# Altium project Modulo_Wifi_Pedidos_Domicilo.PrjPcb
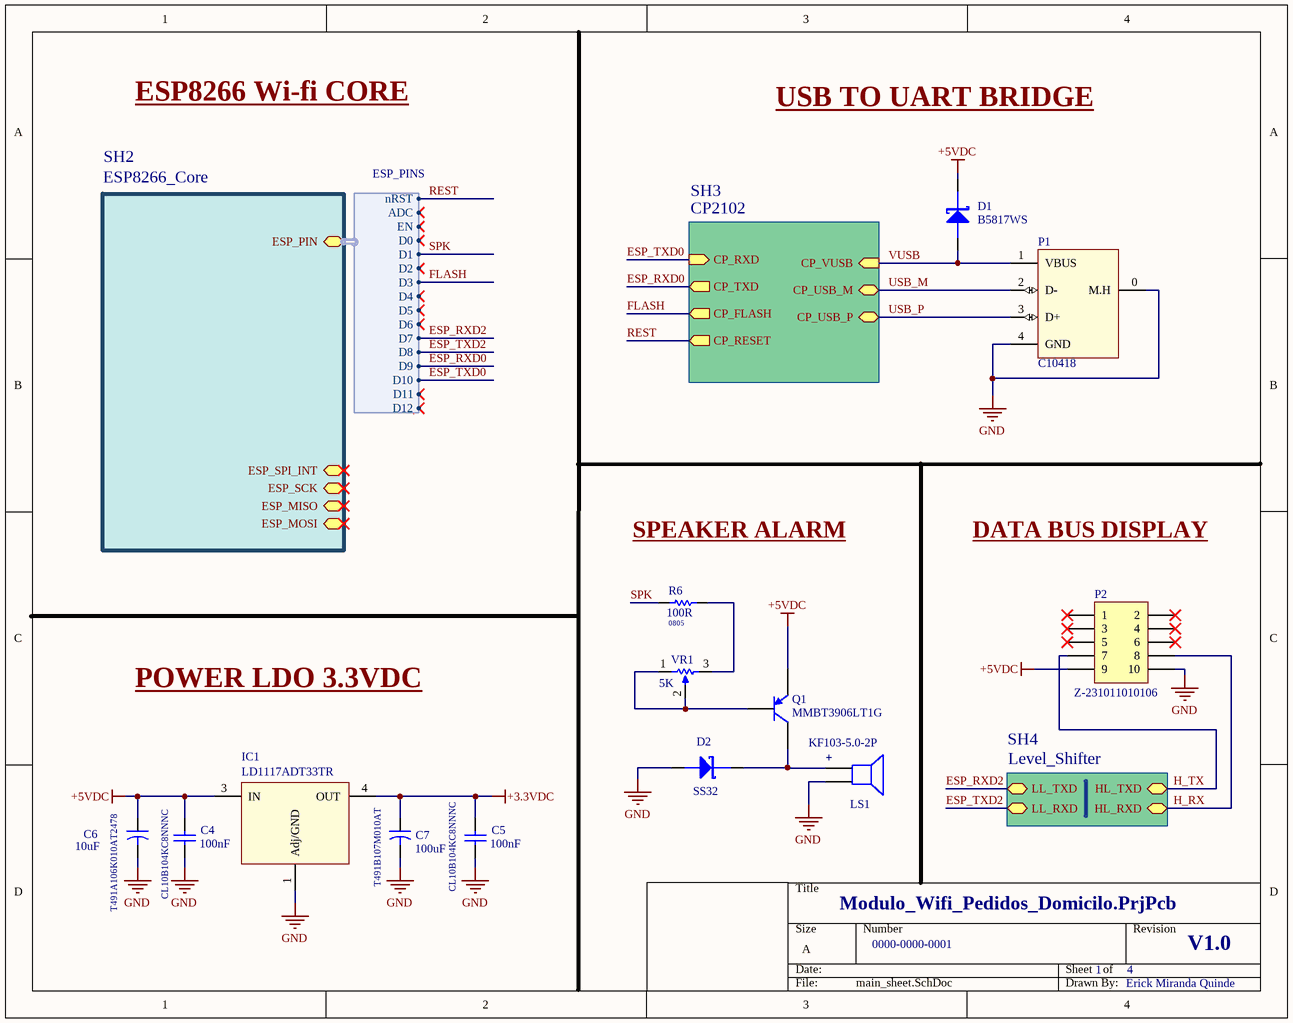
[diagram p0: main_sheet.SchDoc]
5 sheets, 47 parts. Net scope: hierarchical (ports join the sheet entries above them; power ports are global).
Board files: BOARD.PcbDoc, Edge_Board.PcbDoc
Sheets:
  main_sheet.SchDoc
    SH3 = CP2102.SchDoc
  ESP32_Core.SchDoc
  PAM8403.SchDoc
  LD1117.SchDoc

## Sheet main_sheet.SchDoc
size A; Author: Erick Miranda Quinde; DrawnBy: Erick Miranda Quinde; Engineer: Erick Miranda Quinde; DocumentNumber: 0000-0000-0001; Revision: V1.0; SheetNumber: 1; SheetTotal: 4

### Parts
(Parts that share a designator on the sheet are numbered #1, #2 ... from top to bottom, then left to right.)
C4  CL10B104KC8NNNC  value 100nF  [C0603C104K5RACTU]
C5#1  CL10B104KC8NNNC  value 100nF  [C0603C104K5RACTU]
C6#1  T491A106K010AT2478  value 10uF  [3216 Case-A]
C7#1  T491B107M010AT  value 100uF  [TAJB107M006RNJ]
D1  B5817WS  [Diode S4]
D2  SS32  [DO-214AC)]
IC1  LD1117ADT33TR  [TO252]
LS1#1  KF103-5.0-2P  [VERDE 2pin]
P1  C10418  [USB_MICRO_B_AT]
P2  Z-231011010106  [IDC5X2]
Q1  MMBT3906LT1G  [SOT-23-TT3_N]
R6#1  value 100R  Package: 0805  [RES-0805]  (hidden comment: TC0525D1000T5E)
VR1  value 5K  [POT LIN VR1]  (hidden comment: 3362P-1-502LF)

### Sub-sheets
SH2 = ESP8266_Core (file not in this document): ESP_PIN (harness ESP_PINS), ESP_SCK, ESP_MISO, ESP_MOSI, ESP_SPI_INT
SH3 = CP2102: CP_USB_M (bidir), CP_USB_P (bidir), CP_VUSB (in), CP_RXD (in), CP_TXD (out), CP_FLASH (out), CP_RESET (out)
SH4 = Level_Shifter (file not in this document): HL_TXD, HL_RXD, LL_TXD, LL_RXD

### Harnesses
ESP_PINS: D12, D11, D10, D9, D3, D8, D7, D6, D5, D4, D2, D1, D0, EN, ADC, nRST

### Nets
+3.3VDC: C5#1.2 C7#1.1 IC1.4(OUT)
+5VDC: C4.2 C6#1.1 D1.1(K) IC1.3(IN) P2.9 Q1.2(E)
GND: C4.1 C5#1.1 C6#1.2 C7#1.2 D2.2(A) IC1.1(Adj/GND) LS1#1.2 P1.0(M.H) P1.4(GND) P2.10
ESP_RXD0: sheet SH3/CP_TXD, sheet SH2/ESP_PIN.D9
ESP_RXD2: sheet SH4/LL_TXD, sheet SH2/ESP_PIN.D7
ESP_TXD0: sheet SH3/CP_RXD, sheet SH2/ESP_PIN.D10
ESP_TXD2: sheet SH4/LL_RXD, sheet SH2/ESP_PIN.D8
FLASH: sheet SH3/CP_FLASH, sheet SH2/ESP_PIN.D3
H_RX: P2.8 ; sheet SH4/HL_RXD
H_TX: P2.7 ; sheet SH4/HL_TXD
REST: sheet SH3/CP_RESET, sheet SH2/ESP_PIN.nRST  [project net nRST]
SPK: R6#1.1 ; sheet SH2/ESP_PIN.D1
USB_M: P1.2(D-) ; sheet SH3/CP_USB_M
USB_P: P1.3(D+) ; sheet SH3/CP_USB_P
VUSB: D1.2(A) P1.1(VBUS) ; sheet SH3/CP_VUSB
NetD2_1: D2.1(K) LS1#1.1 Q1.3(C)
NetQ1_1: Q1.1(B) VR1.1 VR1.2
NetR6#1_2: R6#1.2 VR1.3

Not connected (* = marked no-connect by the designer): P2 1* 2* 3* 4* 5* 6*

### Notes on the sheet
- ESP8266 Wi-fi CORE
- USB TO UART BRIDGE
- SPEAKER ALARM
- DATA BUS DISPLAY
- POWER LDO 3.3VDC
- (near LS1#1) +

### Library data of the parts
C4 C5#1 = Cap 100nF (0603): PART_NUM: CL10B104KC8NNNC; Price: $0.02; Link Store: https://lcsc.com/product-detail/Multilayer-Ceramic-Capacitors-MLCC-SMD-SMT_SAMSUNG_CL10B104KC8NNNC_100nF-104-10-100V_C15725.html; LCSC Part: C15725
C6#1 = T491A106M006AT: CAP TANT 10UF 6.3V 20% 1206; Price: $0.11; Link Store: https://lcsc.com/product-detail/Tantalum-Capacitors_KEMET_T491A106K010AT_10uF-106-10-10V_C110052.html; LCSC Part: C110052
C7#1 = Cap 10uF (C3216): Capacitor; Price: $0.29; Link Store: https://lcsc.com/product-detail/Tantalum-Capacitors_KEMET-T491B107M010AT_C90975.html; LCSC Part: C90975
D1 = 1N5817: Price: $0.0211; Link Store: https://lcsc.com/product-detail/Schottky-Barrier-Diodes-SBD_Shikues-B5817WS_C122854.html; LCSC Part: C122854
D2 = CD214A-B340LF: DIODE SCHOTTKY 40V 3A SMA; Price: $0.03; Link Store: https://lcsc.com/product-detail/Schottky-Barrier-Diodes-SBD_MDD-Microdiode-Electronics-SS32_C34897.html; LCSC Part: C34897
IC1 = LM1117DT: 800mA Low-Dropout Linear Regulator; Manufacturer: National Semiconductor; Datasheet: http://www.national.com/ds/LM/LM1117.pdf; Price: $0.96; Link Store: https://lcsc.com/product-detail/Low-Dropout-Regulators-LDO_STMicroelectronics-LD1117ADT33TR_C157401.html; LCSC Part: C157401
LS1#1 = Speaker: Published: 24-Mar-1999; LatestRevisionDate: 17-Jul-2002; LatestRevisionNote: Re-released for DXP Platform.; PackageReference: PIN2; Publisher: Altium Limited; Price: $0.12; Link Store: https://lcsc.com/product-detail/New-Quadratic-Unclassified-Data_Cixi-Kefa-Elec-KF103-5-0-2P_C475088.html; LCSC Part: C475088
P1 = USB Mini: USB Micro; Price: $0.06; Link Store: https://lcsc.com/product-detail/USB-Connectors_Jing-Extension-of-the-Electronic-Co-Jing-Extension-of-the-Electronic-Co-MICRO-USB-5S-B-Type-horns-High-temperature_C10418.html; LCSC Part: C10418
P2 = IDC  5X2: Header, 5-Pin, Dual row; LatestRevisionDate: 17-Jul-2002; LatestRevisionNote: Re-released for DXP Platform.; Publisher: Altium Limited; Price: $0.16; Link Store: https://lcsc.com/product-detail/IDC-Connectors_nextron-Nextronics-Engineering-Z-231011010106_C221045.html; LCSC Part: C221045
Q1 = 2N3906: Manufacturer: Micro Commercial Co; Manufacturer Part Number: 2N3906-AP; Transistor Type: PNP; Current - Collector (Ic) (Max): 200mA; Voltage - Collector Emitter Breakdown (Max): 40V; Vce Saturation (Max) @ Ib, Ic: 400mV @ 5mA, 50mA; DC Current Gain (hFE) (Min) @ Ic, Vce: 100 @ 10mA, 1V; Power - Max: 600mW; Frequency - Transition: 250MHz; Supplier 1: Digi-Key; RoHS: RoHS Compliant; Category: Discrete Semiconductor Products; Stock 1: 54000; Pricing 1: 2000=0.0306, 6000=0.0276, 10000=0.024, 50000=0.0192, 100000=0.018, 200000=0.01596 (USD); Packaging: Tape & Box (TB); Current - Collector Cutoff (Max): -; Mounting Type: Through Hole; Package / Case: TO-226-3, TO-92-3 (TO-226AA) Formed Leads; Supplier Device Package: TO-92; ComponentLink1URL: http://www.mccsemi.com/up_pdf/2N3906(TO-92).pdf; ComponentLink1Description: http://www.mccsemi.com/up_pdf/2N3906(TO-92).pdf; Supplier Part Number 1: 2N3906-APTB-ND; Price: $0.0072; Link Store: https://lcsc.com/product-detail/Transistors-NPN-PNP_ON-Semiconductor-MMBT3906LT1G_C53444.html; LCSC Part: C53444
R6#1 = Resistor: Published: 8-Jun-2000; LatestRevisionDate: 17-Jul-2002; LatestRevisionNote: Re-released for DXP Platform.; PackageReference: AXIAL-0.3; Publisher: Altium Limited; PackageDescription: Axial Device, Thru-Hole; 2 Leads; 0.3 in Pin Spacing; Price: $0.024; Link Store: https://lcsc.com/product-detail/High-Precision-Low-TCR-SMD-Resistors_UNI-ROYAL-Uniroyal-Elec-TC0525D1000T5E_C44786.html; LCSC Part: C44786
VR1 = Trimmer Cermet 104: Price: $0.22; PARTNUM: 3362P-1-502LF; Link Store: https://lcsc.com/product-detail/Precision-Potentiometer_BOURNS_3362P-1-502LF_5KR_C81260.html; LCSC Part: C81260

## Sheet CP2102.SchDoc
size A; Author: Erick Miranda Quinde; DrawnBy: Erick Miranda Quinde; DocumentNumber: 0000-0000-0003; Revision: V1.0; SheetNumber: 3; SheetTotal: 4
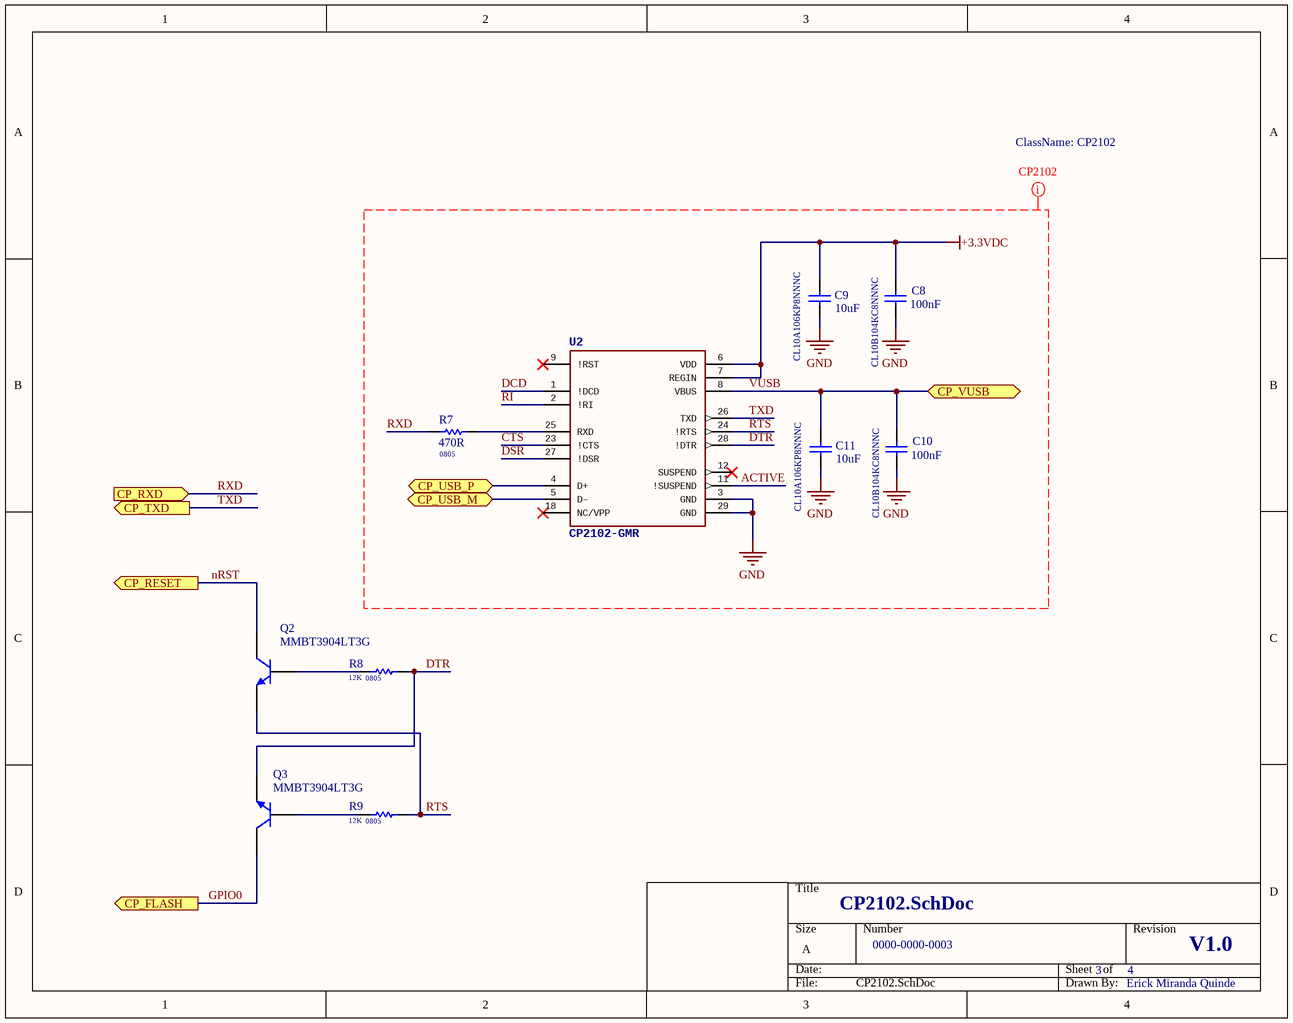
[diagram p1: CP2102.SchDoc]

### Parts
(Parts that share a designator on the sheet are numbered #1, #2 ... from top to bottom, then left to right.)
C8#1  CL10B104KC8NNNC  value 100nF  [C0603C104K5RACTU]
C9#1  CL10A106KP8NNNC  value 10uF  [C0603C104K5RACTU]
C10#1  CL10B104KC8NNNC  value 100nF  [C0603C104K5RACTU]
C11#1  CL10A106KP8NNNC  value 10uF  [C0603C104K5RACTU]
Q2  MMBT3904LT3G  [SOT-23-TT3_N]
Q3  MMBT3904LT3G  [SOT-23-TT3_N]
R7#1  value 470R  Package: 0805  [RES-0805]  (hidden comment: 0805W8F4700T5E)
R8#1  value 12K  Package: 0805  [RES-0805]  (hidden comment: 0805W8F1202T5E)
R9#1  value 12K  Package: 0805  [RES-0805]  (hidden comment: 0805W8F1202T5E)
U2#1  CP2102-GMR  [QFN50P500X500X100-29N]

### Ports
CP_FLASH (out), CP_RESET (out), CP_RXD (in), CP_TXD (out), CP_USB_M (bidir), CP_USB_P (bidir), CP_VUSB

### Nets
+3.3VDC: C8#1.2 C9#1.2 U2#1.6(VDD) U2#1.7(REGIN)
GND: C8#1.1 C9#1.1 C10#1.1 C11#1.1 U2#1.3(GND) U2#1.29(GND)
ACTIVE: U2#1.11(!SUSPEND)
CTS: U2#1.23(!CTS)
DCD: U2#1.1(!DCD)
DSR: U2#1.27(!DSR)
DTR: Q3.2(E) R8#1.2 U2#1.28(!DTR)
GPIO0: Q3.3(C) ; port CP_FLASH  [project net FLASH]
nRST: Q2.3(C) ; port CP_RESET
RI: U2#1.2(!RI)
RTS: Q2.2(E) R9#1.2 U2#1.24(!RTS)
RXD: R7#1.1 ; port CP_RXD  [project net ESP_TXD0]
TXD: U2#1.26(TXD) ; port CP_TXD  [project net ESP_RXD0]
USB_M: U2#1.5(D–) ; port CP_USB_M
USB_P: U2#1.4(D+) ; port CP_USB_P
VUSB: C10#1.2 C11#1.2 U2#1.8(VBUS) ; port CP_VUSB
NetQ2_1: Q2.1(B) R8#1.1
NetQ3_1: Q3.1(B) R9#1.1
NetR7#1_2: R7#1.2 U2#1.25(RXD)

Not connected (* = marked no-connect by the designer): U2#1 9(!RST)* 12(SUSPEND)* 18(NC/VPP)*

### Layout directives
net class CP2102: +3.3VDC, ACTIVE, CTS, DCD, DSR, DTR, GND, RI, RTS, RXD, TXD, VUSB

### Library data of the parts
C8#1 C9#1 C10#1 C11#1 = Cap 100nF (0603)
  C8#1 C10#1: PART_NUM: CL10B104KC8NNNC; Price: $0.02; Link Store: https://lcsc.com/product-detail/Multilayer-Ceramic-Capacitors-MLCC-SMD-SMT_SAMSUNG_CL10B104KC8NNNC_100nF-104-10-100V_C15725.html; LCSC Part: C15725
  C9#1 C11#1: PART_NUM: CL10A106KP8NNNC; Price: $0.04; Link Store: https://lcsc.com/product-detail/Multilayer-Ceramic-Capacitors-MLCC-SMD-SMT_Samsung-Electro-Mechanics-CL10A106KP8NNNC_C19702.html; LCSC Part: C19702
Q2 Q3 = 2N3904: Price: $0.019; Link Store: https://lcsc.com/product-detail/Transistors-NPN-PNP_ON-Semiconductor-ON-MMBT3904LT3G_C150052.html; LCSC Part: C150052
R7#1 R8#1 R9#1 = Resistor: Published: 8-Jun-2000; LatestRevisionDate: 17-Jul-2002; LatestRevisionNote: Re-released for DXP Platform.; PackageReference: AXIAL-0.3; Publisher: Altium Limited; PackageDescription: Axial Device, Thru-Hole; 2 Leads; 0.3 in Pin Spacing
  R7#1: Price: $0.0025; Link Store: https://lcsc.com/product-detail/Chip-Resistor-Surface-Mount_UNI-ROYAL-Uniroyal-Elec-0805W8F4700T5E_C17710.html; LCSC Part: C17710
  R8#1 R9#1: Price: $0.029; Link Store: https://lcsc.com/product-detail/Chip-Resistor-Surface-Mount_UNI-ROYAL-Uniroyal-Elec-0805W8F1202T5E_C17444.html; LCSC Part: C17444
U2#1 = CP2102-GM: MF: Silicon Labs; Package: VFQFN-28 Vishay Siliconix; Price: $1.6; Availability: Unavailable; MP: CP2102-GMR; Link Store: https://lcsc.com/product-detail/USB-ICs_SILICON-LABS_CP2102-GMR_SILICON-LABS-CP2102-GMR_C6568.html; LCSC Part: C6568

## Sheet ESP32_Core.SchDoc
size A; Author: Erick Miranda Quinde; DrawnBy: Erick Miranda Quinde; DocumentNumber: 0000-0000-0002; Revision: V2.0; SheetNumber: 2; SheetTotal: 5
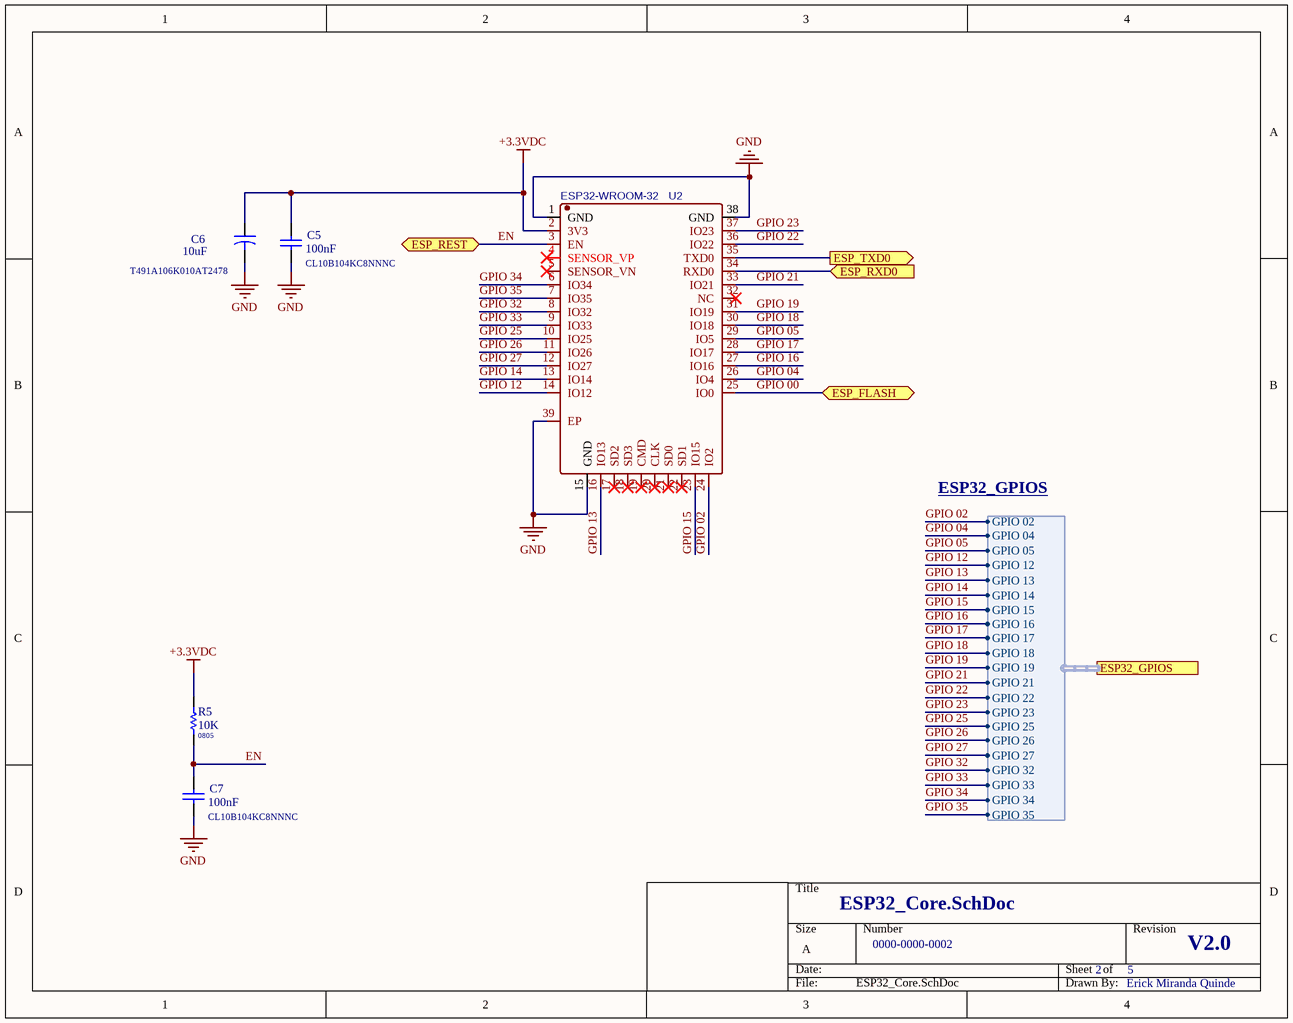
[diagram p2: ESP32_Core.SchDoc]

### Parts
(Parts that share a designator on the sheet are numbered #1, #2 ... from top to bottom, then left to right.)
C5#2  CL10B104KC8NNNC  value 100nF  [C0603C104K5RACTU]
C6#2  T491A106K010AT2478  value 10uF  [3216 Case-A]
C7#2  CL10B104KC8NNNC  value 100nF  [C0603C104K5RACTU]
R5  value 10K  Package: 0805  [RES-0805]  (hidden comment: 0805W8F4700T5E)
U2#2  ESP32-WROOM-32  [ESP-32]

### Ports
ESP32_GPIOS (harness ESP32_GPIOS), ESP_FLASH (bidir), ESP_REST (bidir), ESP_RXD0 (in), ESP_TXD0 (out)

### Harnesses
ESP32_GPIOS: GPIO 02, GPIO 04, GPIO 05, GPIO 12, GPIO 13, GPIO 14, GPIO 15, GPIO 16, GPIO 17, GPIO 18, GPIO 19, GPIO 21, GPIO 22, GPIO 23, GPIO 25, GPIO 26, GPIO 27, GPIO 32, GPIO 33, GPIO 34, GPIO 35

### Nets
+3.3VDC: C5#2.2 C6#2.1 R5.1 U2#2.2(3V3)
GND: C5#2.1 C6#2.2 C7#2.1 U2#2.1(GND) U2#2.15(GND) U2#2.38(GND) U2#2.39(EP)
EN: C7#2.2 R5.2 U2#2.3(EN) ; port ESP_REST
GPIO 00: U2#2.25(IO0) ; port ESP_FLASH
GPIO 02: U2#2.24(IO2) ; port ESP32_GPIOS.GPIO 02
GPIO 04: U2#2.26(IO4) ; port ESP32_GPIOS.GPIO 04
GPIO 05: U2#2.29(IO5) ; port ESP32_GPIOS.GPIO 05
GPIO 12: U2#2.14(IO12) ; port ESP32_GPIOS.GPIO 12
GPIO 13: U2#2.16(IO13) ; port ESP32_GPIOS.GPIO 13
GPIO 14: U2#2.13(IO14) ; port ESP32_GPIOS.GPIO 14
GPIO 15: U2#2.23(IO15) ; port ESP32_GPIOS.GPIO 15
GPIO 16: U2#2.27(IO16) ; port ESP32_GPIOS.GPIO 16
GPIO 17: U2#2.28(IO17) ; port ESP32_GPIOS.GPIO 17
GPIO 18: U2#2.30(IO18) ; port ESP32_GPIOS.GPIO 18
GPIO 19: U2#2.31(IO19) ; port ESP32_GPIOS.GPIO 19
GPIO 21: U2#2.33(IO21) ; port ESP32_GPIOS.GPIO 21
GPIO 22: U2#2.36(IO22) ; port ESP32_GPIOS.GPIO 22
GPIO 23: U2#2.37(IO23) ; port ESP32_GPIOS.GPIO 23
GPIO 25: U2#2.10(IO25) ; port ESP32_GPIOS.GPIO 25
GPIO 26: U2#2.11(IO26) ; port ESP32_GPIOS.GPIO 26
GPIO 27: U2#2.12(IO27) ; port ESP32_GPIOS.GPIO 27
GPIO 32: U2#2.8(IO32) ; port ESP32_GPIOS.GPIO 32
GPIO 33: U2#2.9(IO33) ; port ESP32_GPIOS.GPIO 33
GPIO 34: U2#2.6(IO34) ; port ESP32_GPIOS.GPIO 34
GPIO 35: U2#2.7(IO35) ; port ESP32_GPIOS.GPIO 35
NetU2#2_34: U2#2.34(RXD0) ; port ESP_RXD0
NetU2#2_35: U2#2.35(TXD0) ; port ESP_TXD0

Not connected (* = marked no-connect by the designer): U2#2 4(SENSOR_VP)* 5(SENSOR_VN)* 17(SD2)* 18(SD3)* 19(CMD)* 20(CLK)* 21(SD0)* 22(SD1)* 32(NC)*

### Library data of the parts
C5#2 C7#2 = Cap 100nF (0603): PART_NUM: CL10B104KC8NNNC; Price: $0.02; Link Store: https://lcsc.com/product-detail/Multilayer-Ceramic-Capacitors-MLCC-SMD-SMT_SAMSUNG_CL10B104KC8NNNC_100nF-104-10-100V_C15725.html; LCSC Part: C15725
C6#2 = T491A106M006AT: CAP TANT 10UF 6.3V 20% 1206; Price: $0.11; Link Store: https://lcsc.com/product-detail/Tantalum-Capacitors_KEMET_T491A106K010AT_10uF-106-10-10V_C110052.html; LCSC Part: C110052
R5 = Resistor: Published: 8-Jun-2000; LatestRevisionDate: 17-Jul-2002; LatestRevisionNote: Re-released for DXP Platform.; PackageReference: AXIAL-0.3; Publisher: Altium Limited; PackageDescription: Axial Device, Thru-Hole; 2 Leads; 0.3 in Pin Spacing; Price: $0.0025; Link Store: https://lcsc.com/product-detail/Chip-Resistor-Surface-Mount_UNI-ROYAL-Uniroyal-Elec-0805W8F4700T5E_C17710.html; LCSC Part: C17710
U2#2 = ESP-WROOM-32: Module WIFI Modules RoHS; LatestRevisionDate: 17-Jul-2002; LCSC Part: C95209; Link Store: https://lcsc.com/product-detail/WIFI-Modules_Espressif-Systems-ESP32-WROOM-32_C95209.html; Package: Module; Price: $2.9267; Value: WIFI

## Sheet PAM8403.SchDoc
size A; Author: Erick Miranda Quinde; DrawnBy: Erick Miranda Quinde; DocumentNumber: 0000-0000-0004; Revision: V2.0; SheetNumber: 4; SheetTotal: 5
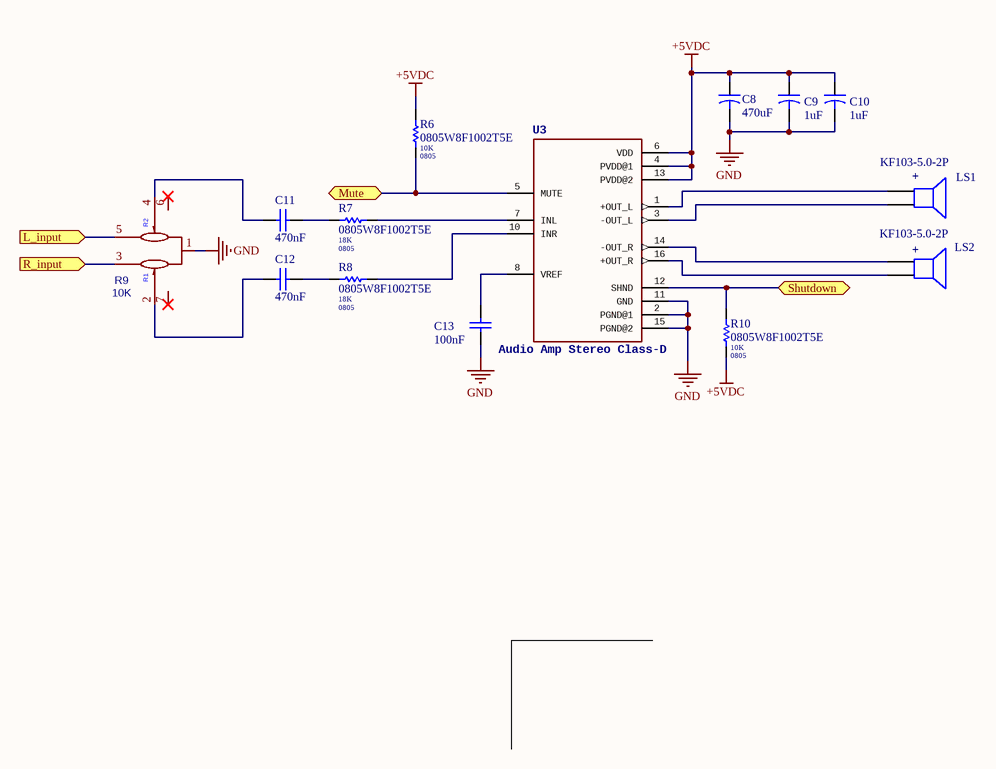
[diagram p3: PAM8403.SchDoc]

### Parts
(Parts that share a designator on the sheet are numbered #1, #2 ... from top to bottom, then left to right.)
C8#2  470uF  [7343–31]
C9#2  1uF  [C3216X5R1C106K]
C10#2  1uF  [C3216X5R1C106K]
C11#2  470nF  [C0603C104K5RACTU]
C12  470nF  [C0603C104K5RACTU]
C13  100nF  [C0603C104K5RACTU]
LS1#2  KF103-5.0-2P  [VERDE 2pin]
LS2  KF103-5.0-2P  [VERDE 2pin]
R6#2  0805W8F1002T5E  value 10K  Package: 0805  [RES-0805]
R7#2  0805W8F1002T5E  value 18K  Package: 0805  [RES-0805]
R8#2  0805W8F1002T5E  value 18K  Package: 0805  [RES-0805]
R9#2  10K  [RES-TH_RK10J12E002L]
R10  0805W8F1002T5E  value 10K  Package: 0805  [RES-0805]
U3  Audio Amp Stereo Class-D  [SOIC-16]

### Ports
L_input (in), Mute (bidir), R_input (in), Shutdown (bidir)

### Nets
+5VDC: C8#2.1 C9#2.1 C10#2.1 R6#2.1 R10.1 U3.4(PVDD@1) U3.6(VDD) U3.13(PVDD@2)
GND: C8#2.2 C9#2.2 C10#2.2 C13.1 R9#2.1 U3.2(PGND@1) U3.11(GND) U3.15(PGND@2)
NetC11#2_1: C11#2.1 R7#2.1
NetC11#2_2: C11#2.2 R9#2.4
NetC12_1: C12.1 R8#2.1
NetC12_2: C12.2 R9#2.2
NetC13_2: C13.2 U3.8(VREF)
NetLS1#2_1: LS1#2.1 U3.1(+OUT_L)
NetLS1#2_2: LS1#2.2 U3.3(-OUT_L)
NetLS2_1: LS2.1 U3.16(+OUT_R)
NetLS2_2: LS2.2 U3.14(-OUT_R)
NetR6#2_2: R6#2.2 U3.5(MUTE) ; port Mute
NetR7#2_2: R7#2.2 U3.7(INL)
NetR8#2_2: R8#2.2 U3.10(INR)
NetR9#2_3: R9#2.3 ; port R_input
NetR9#2_5: R9#2.5 ; port L_input
NetR10_2: R10.2 U3.12(SHND) ; port Shutdown

Not connected (* = marked no-connect by the designer): R9#2 6(EH)* 7(EH)*

### Notes on the sheet
- (near LS1#2) +
- (near LS2) +
- (in symbol 10K) R2; R1

### Library data of the parts
C8#2 = Cap 470uF-6.3V Tantalium: Capacitor; Value: 470uF
C9#2 C10#2 = Cap 10uF (C3216): Capacitor; Value: 1uF
C11#2 C12 C13 = Cap 100nF (0603)
  C11#2 C12: Value: 470nF
  C13: Value: 100nF
LS1#2 LS2 = Speaker: Published: 24-Mar-1999; LatestRevisionDate: 17-Jul-2002; LatestRevisionNote: Re-released for DXP Platform.; PackageReference: PIN2; Publisher: Altium Limited; Price: $0.12; Link Store: https://lcsc.com/product-detail/New-Quadratic-Unclassified-Data_Cixi-Kefa-Elec-KF103-5-0-2P_C475088.html; LCSC Part: C475088
R6#2 R7#2 R8#2 R10 = Resistor: Published: 8-Jun-2000; LatestRevisionDate: 17-Jul-2002; LatestRevisionNote: Re-released for DXP Platform.; PackageReference: AXIAL-0.3; Publisher: Altium Limited; PackageDescription: Axial Device, Thru-Hole; 2 Leads; 0.3 in Pin Spacing; Price: $0.0023; Link Store: https://lcsc.com/product-detail/Chip-Resistor-Surface-Mount_UNI-ROYAL-Uniroyal-Elec-0805W8F1002T5E_C17414.html; LCSC Part: C17414
R9#2 = 10K: BOM_Manufacturer: ALPS Electric; BOM_Manufacturer Part: RK10J12E002L; nameAlias: Resistance (Ohms); Contributor: LCSC; BOM_Supplier: LCSC; BOM_Supplier Part: C231765; spicePre: R; spiceSymbolName: RK10J12E002L
U3 = PAM8403DR: MF: Diodes Inc.; MP: PAM8403DR; Price: Average Price: / $0.44 USD; Availability: Good; Package: None

## Sheet LD1117.SchDoc
size A; Author: Erick Miranda Quinde; DrawnBy: Erick Miranda Quinde; DocumentNumber: 0000-0000-0005; Revision: V2.0; SheetNumber: 5; SheetTotal: 5
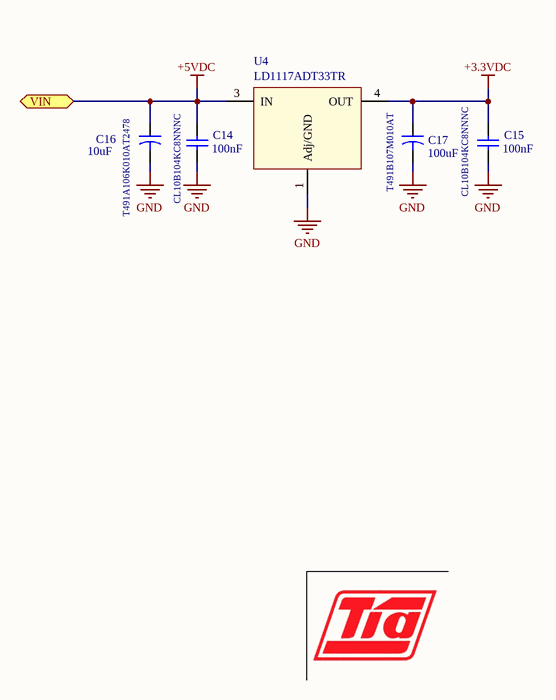
[diagram p4: LD1117.SchDoc]

### Parts
C14  CL10B104KC8NNNC  value 100nF  [C0603C104K5RACTU]
C15  CL10B104KC8NNNC  value 100nF  [C0603C104K5RACTU]
C16  T491A106K010AT2478  value 10uF  [3216 Case-A]
C17  T491B107M010AT  value 100uF  [TAJB107M006RNJ]
U4  LD1117ADT33TR  [TO252]

### Ports
VIN (bidir)

### Nets
+3.3VDC: C15.2 C17.1 U4.4(OUT)
+5VDC: C14.2 C16.1 U4.3(IN) ; port VIN
GND: C14.1 C15.1 C16.2 C17.2 U4.1(Adj/GND)

### Library data of the parts
C14 C15 = Cap 100nF (0603): PART_NUM: CL10B104KC8NNNC; Price: $0.02; Link Store: https://lcsc.com/product-detail/Multilayer-Ceramic-Capacitors-MLCC-SMD-SMT_SAMSUNG_CL10B104KC8NNNC_100nF-104-10-100V_C15725.html; LCSC Part: C15725
C16 = T491A106M006AT: CAP TANT 10UF 6.3V 20% 1206; Price: $0.11; Link Store: https://lcsc.com/product-detail/Tantalum-Capacitors_KEMET_T491A106K010AT_10uF-106-10-10V_C110052.html; LCSC Part: C110052
C17 = Cap 10uF (C3216): Capacitor; Price: $0.29; Link Store: https://lcsc.com/product-detail/Tantalum-Capacitors_KEMET-T491B107M010AT_C90975.html; LCSC Part: C90975
U4 = LM1117DT: as IC1 on sheet main_sheet; Datasheet: http://www.national.com/ds/LM/LM1117.pdf; Price: $0.96; Link Store: https://lcsc.com/product-detail/Low-Dropout-Regulators-LDO_STMicroelectronics-LD1117ADT33TR_C157401.html; LCSC Part: C157401

## Nets that join several sheets
+3.3VDC: main_sheet (C5#1.2 C7#1.1 IC1.4), CP2102 (C8#1.2 C9#1.2 U2#1.6 U2#1.7), ESP32_Core (C5#2.2 C6#2.1 R5.1 U2#2.2), LD1117 (C15.2 C17.1 U4.4)
+5VDC: main_sheet (6 pins), PAM8403 (8 pins), LD1117 (C14.2 C16.1 U4.3)
GND: main_sheet (10 pins), CP2102 (6 pins), ESP32_Core (7 pins), PAM8403 (8 pins), LD1117 (5 pins)
USB_M: main_sheet (P1.2), CP2102 (U2#1.5)
USB_P: main_sheet (P1.3), CP2102 (U2#1.4)
VUSB: main_sheet (D1.2 P1.1), CP2102 (C10#1.2 C11#1.2 U2#1.8)